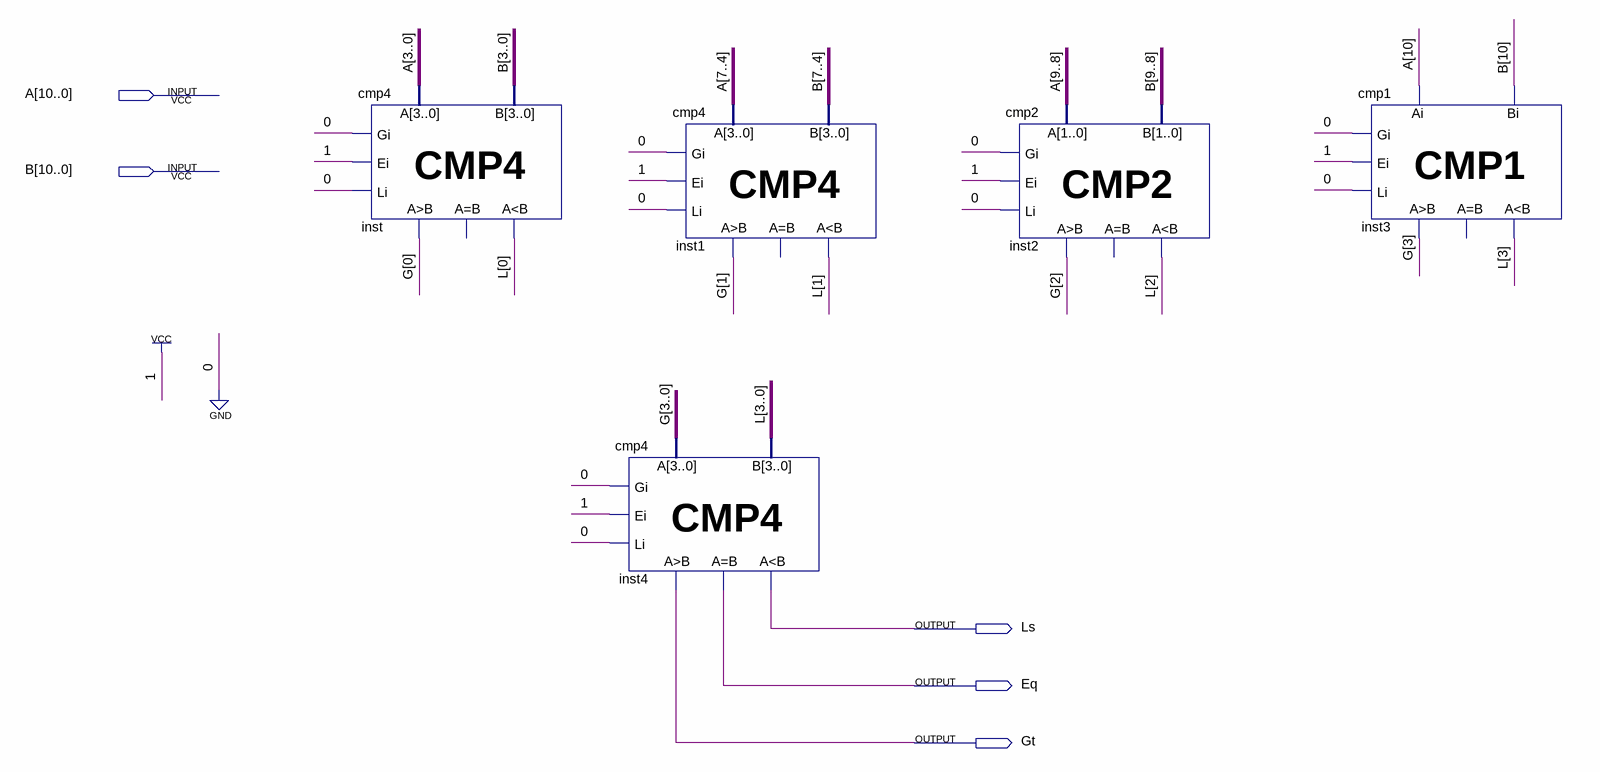
[diagram p0: schematic sheet]
// Quartus schematic cmp11.bdf as structural Verilog: 5 symbols, 5 pins
module cmp11 (
  input  [10:0] A,
  input  [10:0] B,
  output Ls,
  output Eq,
  output Gt
);

  wire [3:0] G, L;

  cmp4 inst (.A(A[3:0]), .B(B[3:0]), .Gi(1'b0), .Ei(1'b1), .Li(1'b0), .Gi_1(G[0]), .Li_1(L[0]));  // open: Ei_1
  cmp4 inst4 (.A(G), .B(L), .Gi(1'b0), .Ei(1'b1), .Li(1'b0), .Gi_1(Gt), .Ei_1(Eq), .Li_1(Ls));
  cmp4 inst1 (.A(A[7:4]), .B(B[7:4]), .Gi(1'b0), .Ei(1'b1), .Li(1'b0), .Gi_1(G[1]), .Li_1(L[1]));  // open: Ei_1
  cmp2 inst2 (.A(A[9:8]), .B(B[9:8]), .Gi(1'b0), .Ei(1'b1), .Li(1'b0), .Gi_1(G[2]), .Li_1(L[2]));  // open: Ei_1
  cmp1 inst3 (.Ai(A[10]), .Bi(B[10]), .Gi(1'b0), .Ei(1'b1), .Li(1'b0), .Gi_1(G[3]), .Li_1(L[3]));  // open: Ei_1
endmodule
